# EAGLE design smd_missing_pulse_detector_sot23 (EAGLE 9.6.2)
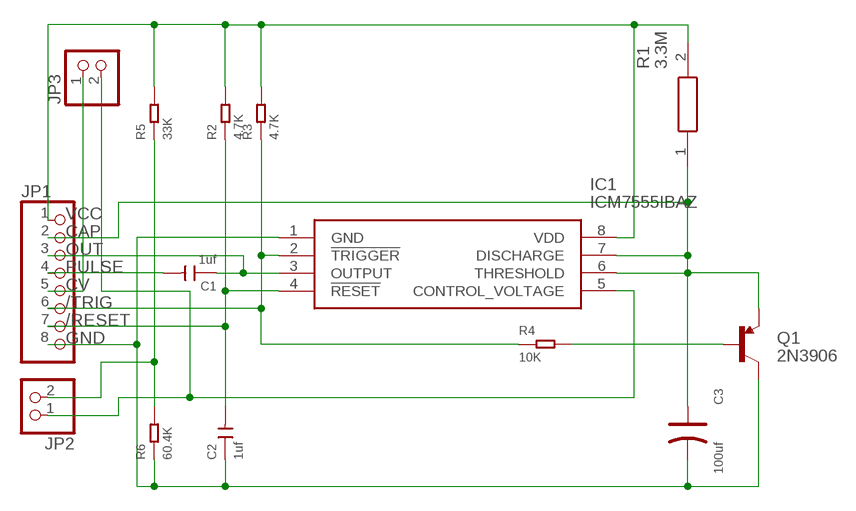
[diagram p0: schematic, sheet 1]

## Parts
C1  1uf  CERAMIC-1UF-25V-10%-X7R(0805)  [C0805]
C2  1uf  CERAMIC-1UF-25V-10%-X7R(0805)  [C0805]
C3  100uf  TANTALUM-SMD-100UF-10V(AVX-B)  [AVX-B]
IC1  ICM7555IBAZ  [SOIC127P600X175-8N]
JP1  PINHD-1X8  [1X08]
JP2  PINHD-1X2  [1X02]
JP3  PINHD-1X2  [1X02]
Q1  2N3906  TRANSISTOR_PNPPMBT3906  [SOT23-3]
R1  3.3M  CRCW06033M30FKEA  [RESC1608X50N]
R2  4.7K  SMD-RES-4.7K-5%-1/10W(0603)  [R0603]
R3  4.7K  SMD-RES-4.7K-5%-1/10W(0603)  [R0603]
R4  10K  SMD-RES-10K-1%-1/10W(0603)  [R0603]
R5  33K  SMD-RES-4.7K-5%-1/10W(0603)  [R0603]
R6  60.4K  SMD-RES-4.7K-5%-1/10W(0603)  [R0603]

## Nets
/RESET: C2.2 IC1.4(!RESET) JP1.7 R2.1
/TRIG: IC1.2(!TRIGGER) JP1.6 R3.1 R4.1
CAP: C3.+ IC1.6(THRESHOLD) IC1.7(DISCHARGE) JP1.2 Q1.2(E) R1.1
CV: IC1.5(CONTROL_VOLTAGE) JP2.1 JP3.2
GND: C2.1 C3.- IC1.1(GND) JP1.8 Q1.3(C) R6.1
N$1: Q1.1(B) R4.2
N$2: JP2.2 R5.1 R6.2
N$3: JP1.5 JP3.1
OUT: C1.1 IC1.3(OUTPUT) JP1.3
PULSE: C1.2 JP1.4
VCC: IC1.8(VDD) JP1.1 R1.2 R2.2 R3.2 R5.2

## Library data of the parts
C1 C2 = OPL_Capacitor:CERAMIC-1UF-25V-10%-X7R(0805): 302010179; MPN: CC0805KKX7R8BB105
C3 = OPL_Capacitor:TANTALUM-SMD-100UF-10V(AVX-B): 302020015; MPN: TAJB107M010#NJ
IC1 = ICM7555IBAZ:ICM7555IBAZ: ICM7555IBAZ, General Purpose Timer 1MHz, 2 to 18V, 8-Pin SOIC-8 Source: Datasheet <https://datasheet.datasheetarchive.com/originals/distributors/SFDatasheet-6/sf-000136291.pdf>; ARROW_PART_NUMBER: ICM7555IBAZ; ARROW_PRICE-STOCK: https://www.arrow.com/en/products/icm7555ibaz/intersil; DESCRIPTION: ICM7555IBAZ, General Purpose Timer 1MHz, 2 to 18V, 8-Pin SOIC-8; HEIGHT: 1.75mm; MANUFACTURER_NAME: Intersil; MANUFACTURER_PART_NUMBER: ICM7555IBAZ; MOUSER_PART_NUMBER: 968-ICM7555IBAZ; MOUSER_PRICE-STOCK: https://www.mouser.com/Search/ProductDetail.aspx?qs=9fLuogzTs8Jv0Cw4QvRWRA%3d%3d
JP1 = Connector:PINHD-1X8: PIN HEADER; CATEGORY: CONNECTOR; SUB-CATEGORY: PIN-HEADER
JP2 JP3 = Connector:PINHD-1X2: PIN HEADER; CATEGORY: CONNECTOR; SUB-CATEGORY: PIN-HEADER
Q1 = User-Submitted:TRANSISTOR_PNP: Generic PNP BJT Double check pinouts against datasheets- not all devices are the same! MMBT3906 - 40V 200mA SOT-23 (TRANS-08052) MMBT4403 - 40V 600mA SOT-23 (TRANS-09245); PROD_ID: TRANS-08052; VALUE: PMBT3906
R1 = CRCW06033M30FKEA:CRCW06033M30FKEA: CRCW0603 Resistor T/R 0.10W,1%,3M3 Vishay CRCW Series Thick Film Surface Mount Resistor 0603 Case 3.3M +/-1% 0.1W +/-100ppm/C Source: Datasheet <http://www.vishay.com/docs/20035/dcrcwe3.pdf>; ARROW_PART_NUMBER: CRCW06033M30FKEA; ARROW_PRICE-STOCK: https://www.arrow.com/en/products/crcw06033m30fkea/vishay; DESCRIPTION: CRCW0603 Resistor T/R 0.10W,1%,3M3 Vishay CRCW Series Thick Film Surface Mount Resistor 0603 Case 3.3M +/-1% 0.1W +/-100ppm/C; HEIGHT: 0.5mm; MANUFACTURER_NAME: Vishay; MANUFACTURER_PART_NUMBER: CRCW06033M30FKEA; MOUSER_PART_NUMBER: 71-CRCW06033M30FKEA; MOUSER_PRICE-STOCK: https://www.mouser.co.uk/ProductDetail/Vishay-Dale/CRCW06033M30FKEA?qs=xDiHhyYQ5oswxJh74ZTuZg%3D%3D
R2 R3 = OPL_Resistor:SMD-RES-4.7K-5%-1/10W(0603): 301010290; MPN: RC0603JR-074K7L
R4 = OPL_Resistor:SMD-RES-10K-1%-1/10W(0603): 301011970; MPN: RC0603FR-0710KL
R5 R6 = OPL_Resistor:SMD-RES-4.7K-5%-1/10W(0603): 301010290; MPN: RC0603JR-074K7L; VALUE: 4.7K

## Board
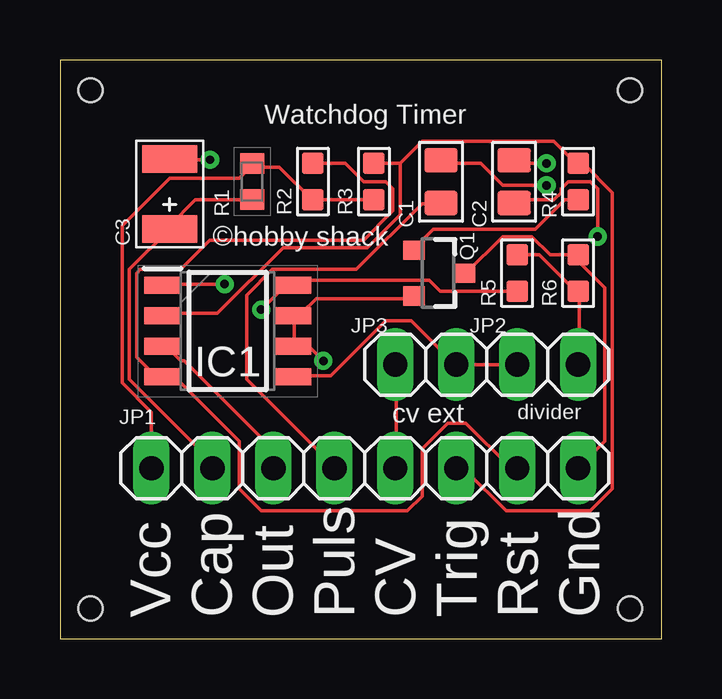
[diagram p1: board, top side]
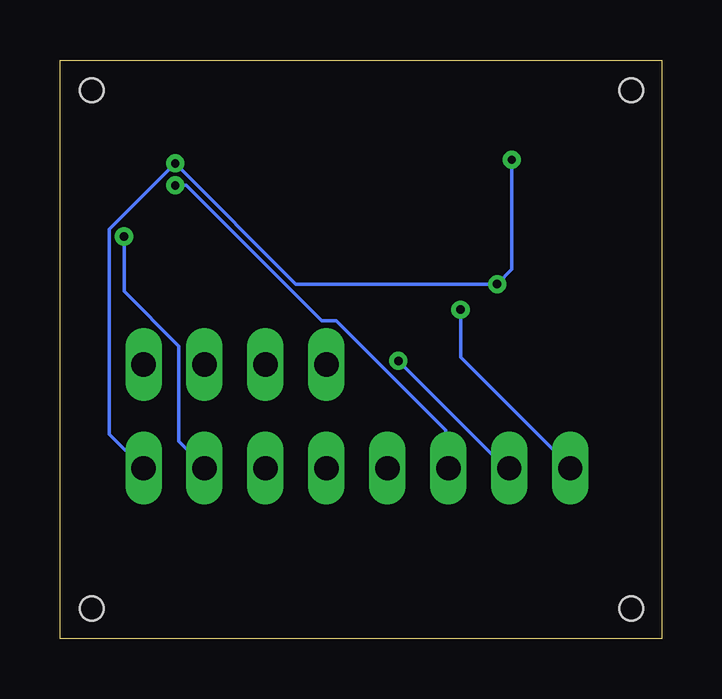
[diagram p2: board, bottom side, seen from below]

Size 25.07 x 24.12 mm. Coordinates in mm from the lower left corner, seen from the top.
Outline: 0,0 25.07,0 25.07,24.12 0,24.12 0,0
Copper layers (1*16): Top 0.035mm / dielectric 1.5mm / Bottom 0.035mm
Design rules "default": minimum track width 6mil, minimum drill 0.35mm, track to track 6mil, track to pad 6mil, pad to pad 6mil, via to via 6mil, smd to smd 6mil, copper to edge 40mil, drill to drill 6mil, minimum pad ring 10mil, minimum via ring 8mil, stop-mask expansion 4mil, vias tented up to drill 0mil, thermal gap 10mil
Holes 1 mm at 1.27,22.86 23.75,22.86 1.27,1.27 23.75,1.27

### Footprints (pad centres in the part's own frame; a part is rotated, then mirrored left to right if it is on the bottom)
C0805 = smd 1.397 x 1.016: 1 0,0.889; 2 0,-0.889
AVX-B = smd 1.143 x 2.286: + -1.46,0; - 1.46,0
SOIC127P600X175-8N = smd 1.525 x 0.7: 1 -2.712,1.905; 2 -2.712,0.635; 3 -2.712,-0.635; 4 -2.712,-1.905; 5 2.712,-1.905; 6 2.712,-0.635; 7 2.712,0.635; 8 2.712,1.905
1X08 = drill 1.016 long: 1 -8.89,0; 2 -6.35,0; 3 -3.81,0; 4 -1.27,0; 5 1.27,0; 6 3.81,0; 7 6.35,0; 8 8.89,0
1X02 = drill 1.016 long: 1 -1.27,0; 2 1.27,0
SOT23-3 = smd 0.8 x 0.9: 1 -0.95,-1; 2 0.95,-1; 3 0,1.1
RESC1608X50N = smd 0.85 x 1: 1 -0.75,0; 2 0.75,0
R0603 = smd 0.889 x 0.889: 1 0,0.762; 2 0,-0.762

### Placement (x,y rotation side)
C1  15.88,19.05 0 top
C2  18.92,19.05 0 top
C3  4.57,18.54 90 top
IC1  6.99,12.83 0 top
JP1  12.7,7.11 0 top
JP2  20.32,11.43 0 top
JP3  15.24,11.43 0 top
Q1  15.75,15.24 270 top
R1  8,19.05 90 top
R2  10.54,19.05 0 top
R3  13.08,19.05 0 top
R4  21.59,19.05 0 top
R5  19.05,15.24 0 top
R6  21.59,15.24 0 top

### Tracks (layer width: path | path; a pad name or v marks a point on that pad's centre or on a via)
/RESET  (via drill 0.35)
  Top 0.152: v22.4,16.76 22.4,18.75 22.1,19.05 21.18,19.05 20.88,18.75 20.88,18.59 20.57,18.29 19.05,18.29 C2.2 | R2.1 11.89,19.81 12.65,19.05 13.56,19.05 13.87,18.75 13.87,17.83 12.65,16.61 6.25,16.61 5.03,15.39 3.35,15.39 3.2,15.24 3.2,11.73 3.96,10.97 4.27,10.97 IC1.4 4.42,10.82 4.88,10.82 7.47,8.23 7.47,6.25 8.38,5.33 14.48,5.33 15.09,5.94 15.09,7.92 16.15,8.99 16.92,8.99 18.75,7.16 19.05,7.16 JP1.7
  Bottom 0.152: v22.4,16.76 22.4,14.48 20.12,12.19 20.12,8.23 19.05,7.16 JP1.7
/TRIG
  Top 0.152: 14.17,19.81 R3.1 | 14.17,19.81 15.09,20.73 20.57,20.73 21.49,19.81 R4.1 21.79,19.81 23.01,18.59 23.01,6.25 22.1,5.33 18.59,5.33 16.92,7.01 16.61,7.01 JP1.6 | 14.17,19.81 14.17,17.68 12.8,16.31 9.3,16.31 6.55,13.56 4.42,13.56 IC1.2
CAP  (via drill 0.35)
  Top 0.152: Q1.2 14.63,14.17 10.67,14.17 10.06,13.56 9.75,13.56 IC1.7 9.75,13.41 9.75,12.19 | R1.1 7.92,18.29 5.64,18.29 4.57,17.22 C3.+ 4.57,17.07 2.9,15.39 2.9,10.82 6.25,7.47 6.25,7.16 JP1.2 | 9.75,12.19 10.36,12.19 v10.97,11.58 | 9.75,12.19 IC1.6
  Bottom 0.152: v10.97,11.58 6.4,7.01 JP1.2
CV
  Top 0.152: IC1.5 9.75,10.97 11.28,10.97 13.56,13.26 14.63,13.26 16.46,11.43 JP3.2 JP2.1
GND  (via drill 0.35)
  Top 0.152: Q1.3 16.92,15.24 18.44,16.76 19.66,16.76 20.42,16 R6.1 21.64,16 21.64,15.7 22.71,14.63 22.71,8.23 JP1.8 | v20.27,19.81 19.05,19.81 C2.1 | v6.86,14.78 4.42,14.78 IC1.1 | v6.25,19.96 4.57,19.96 C3.-
  Bottom 0.152: JP1.8 23.01,8.53 23.01,17.07 v20.27,19.81 15.24,14.78 v6.86,14.78 6.25,15.39 v6.25,19.96
N$1
  Top 0.152: R4.2 21.03,18.29 19.81,17.07 15.54,17.07 14.78,16.31 Q1.1
N$2
  Top 0.152: JP2.2 21.64,11.43 21.64,14.48 R6.2 21.49,14.48 19.96,16 R5.1
N$3
  Top 0.152: JP1.5 14.02,7.16 14.02,11.43 JP3.1
OUT  (via drill 0.35)
  Top 0.152: v20.27,18.9 18.44,18.9 17.53,19.81 16,19.81 C1.1 | IC1.3 4.42,12.19 5.03,11.58 5.18,11.58 8.84,7.92 8.84,7.16 JP1.3
  Bottom 0.152: v20.27,18.9 19.81,18.9 14.17,13.26 13.56,13.26 8.99,8.69 8.99,7.16 JP1.3
PULSE
  Top 0.152: C1.2 15.85,18.14 15.09,18.14 12.34,15.39 8.84,15.39 7.77,14.33 7.77,10.82 11.43,7.16 JP1.4
VCC  (via drill 0.35)
  Top 0.152: R5.2 15.85,14.48 15.39,14.94 9.91,14.94 9.75,14.78 IC1.8 9.6,14.63 9.3,14.63 v8.38,13.72 | R3.2 R2.2 10.52,18.29 9.14,19.66 8.08,19.66 R1.2 7.92,19.66 7.47,19.2 4.57,19.2 2.59,17.22 2.59,10.67 3.81,9.45 JP1.1
  Bottom 0.152: v8.38,13.72 8.38,11.73 3.81,7.16 JP1.1

### Text on the board
tNames: Watchdog Timer | ©hobby shack | cv ext | divider | Vcc / Cap / Out / Puls / CV / Trig / Rst / Gnd